# EAGLE schematic Side Panel Experement - 6 cells (EAGLE 7.6.0)
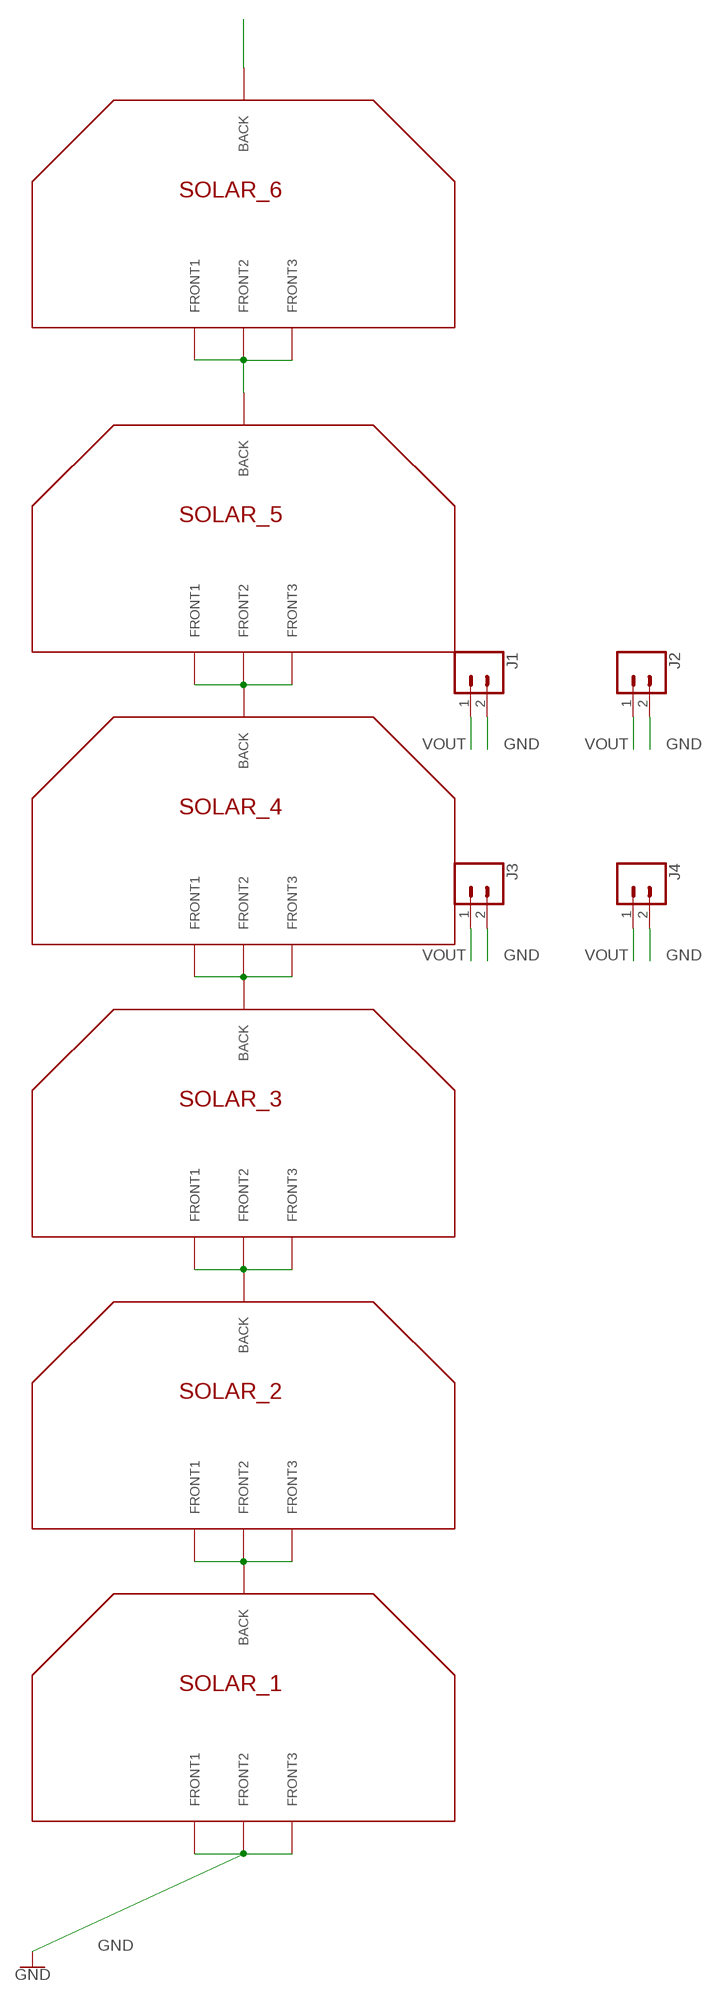
[diagram p0: schematic, sheet 1]

## Parts
J1  CONN_02  [1X02]
J2  CONN_02  [1X02]
J3  CONN_02  [1X02]
J4  CONN_02  [1X02]
SOLAR_1  SOLAR_CELL_HALF_TABSFULL_TABS  [SOLAR_CELL_3G30A_FULL_TABS]
SOLAR_2  SOLAR_CELL_HALF_TABSFULL_TABS  [SOLAR_CELL_3G30A_FULL_TABS]
SOLAR_3  SOLAR_CELL_HALF_TABSFULL_TABS  [SOLAR_CELL_3G30A_FULL_TABS]
SOLAR_4  SOLAR_CELL_HALF_TABSFULL_TABS  [SOLAR_CELL_3G30A_FULL_TABS]
SOLAR_5  SOLAR_CELL_HALF_TABSFULL_TABS  [SOLAR_CELL_3G30A_FULL_TABS]
SOLAR_6  SOLAR_CELL_HALF_TABSFULL_TABS  [SOLAR_CELL_3G30A_FULL_TABS]

## Nets
1-2 [PANEL]: SOLAR_1.P$1(BACK) SOLAR_2.P$F1(FRONT1) SOLAR_2.P$F2(FRONT2) SOLAR_2.P$F3(FRONT3)
2-3 [PANEL]: SOLAR_2.P$1(BACK) SOLAR_3.P$F1(FRONT1) SOLAR_3.P$F2(FRONT2) SOLAR_3.P$F3(FRONT3)
3-4 [PANEL]: SOLAR_3.P$1(BACK) SOLAR_4.P$F1(FRONT1) SOLAR_4.P$F2(FRONT2) SOLAR_4.P$F3(FRONT3)
4-5 [PANEL]: SOLAR_4.P$1(BACK) SOLAR_5.P$F1(FRONT1) SOLAR_5.P$F2(FRONT2) SOLAR_5.P$F3(FRONT3)
GND [PANEL]: J1.2 J2.2 J3.2 J4.2 SOLAR_1.P$F1(FRONT1) SOLAR_1.P$F2(FRONT2) SOLAR_1.P$F3(FRONT3)
N$9: SOLAR_5.P$1(BACK) SOLAR_6.P$F1(FRONT1) SOLAR_6.P$F2(FRONT2) SOLAR_6.P$F3(FRONT3)
N$10: SOLAR_6.P$1(BACK)
VOUT [PANEL]: J1.1 J2.1 J3.1 J4.1

## Library data of the parts
J1-J4 = SparkFun-Connectors:CONN_02: Multi connection point. Often used as Generic Header-pin footprint for 0.1 inch spaced/style header connections On any of the 0.1 inch spaced packages, you can populate with these: Break Away Headers - Straight <https://www.sparkfun.com/products/116> (PRT-00116) Break Away Male Headers - Right Angle <https://www.sparkfun.com/products/553> (PRT-00553) Female Headers <https://www.sparkfun.com/products/115> (PRT-00115) Break Away Headers - Machine Pin <https://www.sparkfun.com/products/117> (PRT-00117) Break Away Female Headers - Swiss Machine Pin <https://www.sparkfun.com/products/743> (PRT-00743) For SCREWTERMINALS and SPRING TERMINALS visit here: Screw Terimnals on SparkFun.com <https://www.sparkfun.com/search/results?term=Screw+Terminals> (5mm/3.5mm/2.54mm spacing) This device is also useful as a general connection point to wire up your design to another part of your project. Our various solder wires solder well into these plated through hole pads. Hook-Up Wire - Assortment (Stranded, 22 AWG) <https://www.sparkfun.com/products/11375> (PRT-11375) Hook-Up Wire - Assortment (Solid Core, 22 AWG) <https://www.sparkfun.com/products/11367> (PRT-11367) View the entire wire category on our website here <https://www.sparkfun.com/categories/141> Special notes: Molex polarized connector foot print use with: PRT-08233 with associated crimp pins and housings. 2.54_SCREWTERM for use with PRT-10571. 3.5mm Screw Terminal footprints for PRT-08084 5mm Screw Terminal footprints for use with PRT-08432
SOLAR_1-SOLAR_6 = CubeSat(V2.3):SOLAR_CELL_HALF_TABS

## Net classes
1 PANEL: width 0.635 mm, drill 0.254 mm, clearance 0.381 mm